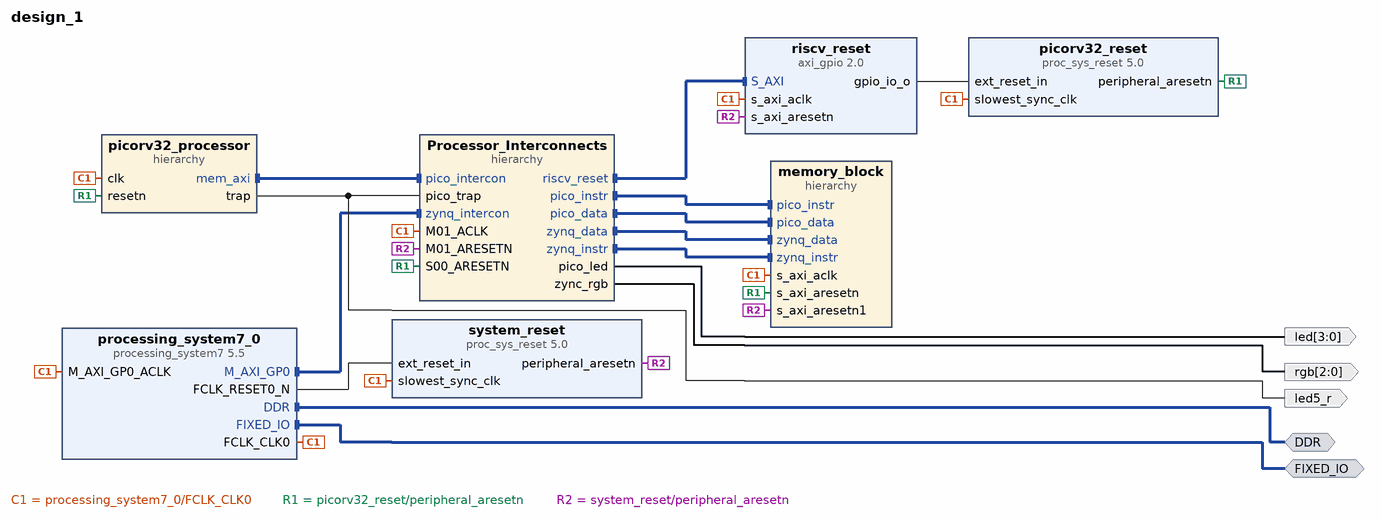
[diagram p0: block diagram of the top level]
# Vivado block design design_1, xc7z020clg400-1, Vivado 2023.2
create_bd_design design_1

create_bd_intf_port -mode Master -vlnv xilinx.com:interface:ddrx_rtl:1.0 DDR
create_bd_intf_port -mode Master -vlnv xilinx.com:display_processing_system7:fixedio_rtl:1.0 FIXED_IO
create_bd_port -dir O -from 3 -to 0 led
create_bd_port -dir O -from 2 -to 0 rgb
create_bd_port -dir O led5_r

create_bd_cell -type ip -vlnv xilinx.com:ip:proc_sys_reset:5.0 system_reset
create_bd_cell -type ip -vlnv xilinx.com:ip:processing_system7:5.5 processing_system7_0
set_property -dict [list \
  CONFIG.PCW_APU_PERIPHERAL_FREQMHZ 650 \
  CONFIG.PCW_CRYSTAL_PERIPHERAL_FREQMHZ 50 \
  CONFIG.PCW_ENET0_ENET0_IO {MIO 16 .. 27} \
  CONFIG.PCW_ENET0_GRP_MDIO_ENABLE 1 \
  CONFIG.PCW_ENET0_GRP_MDIO_IO {MIO 52 .. 53} \
  CONFIG.PCW_ENET0_PERIPHERAL_ENABLE 1 \
  CONFIG.PCW_ENET0_RESET_ENABLE 1 \
  CONFIG.PCW_ENET0_RESET_IO {MIO 9} \
  CONFIG.PCW_ENET_RESET_ENABLE 1 \
  CONFIG.PCW_ENET_RESET_SELECT {Share reset pin} \
  CONFIG.PCW_FPGA0_PERIPHERAL_FREQMHZ 100 \
  CONFIG.PCW_FPGA1_PERIPHERAL_FREQMHZ 50 \
  CONFIG.PCW_GPIO_MIO_GPIO_ENABLE 1 \
  CONFIG.PCW_GPIO_MIO_GPIO_IO MIO \
  CONFIG.PCW_I2C_RESET_ENABLE 1 \
  CONFIG.PCW_M_AXI_GP0_FREQMHZ 10 \
  CONFIG.PCW_PERIPHERAL_BOARD_PRESET None \
  CONFIG.PCW_PRESET_BANK1_VOLTAGE {LVCMOS 1.8V} \
  CONFIG.PCW_QSPI_GRP_FBCLK_ENABLE 1 \
  CONFIG.PCW_QSPI_GRP_FBCLK_IO {MIO 8} \
  CONFIG.PCW_QSPI_GRP_SINGLE_SS_ENABLE 1 \
  CONFIG.PCW_QSPI_GRP_SINGLE_SS_IO {MIO 1 .. 6} \
  CONFIG.PCW_QSPI_PERIPHERAL_ENABLE 1 \
  CONFIG.PCW_QSPI_QSPI_IO {MIO 1 .. 6} \
  CONFIG.PCW_SD0_GRP_CD_ENABLE 1 \
  CONFIG.PCW_SD0_GRP_CD_IO {MIO 47} \
  CONFIG.PCW_SD0_GRP_WP_ENABLE 0 \
  CONFIG.PCW_SD0_PERIPHERAL_ENABLE 1 \
  CONFIG.PCW_SD0_SD0_IO {MIO 40 .. 45} \
  CONFIG.PCW_SDIO_PERIPHERAL_FREQMHZ 50 \
  CONFIG.PCW_SINGLE_QSPI_DATA_MODE x4 \
  CONFIG.PCW_UART0_PERIPHERAL_ENABLE 1 \
  CONFIG.PCW_UART0_UART0_IO {MIO 14 .. 15} \
  CONFIG.PCW_UART1_PERIPHERAL_ENABLE 0 \
  CONFIG.PCW_UART_PERIPHERAL_FREQMHZ 100 \
  CONFIG.PCW_UIPARAM_DDR_BUS_WIDTH {16 Bit} \
  CONFIG.PCW_UIPARAM_DDR_FREQ_MHZ 525 \
  CONFIG.PCW_UIPARAM_DDR_PARTNO {MT41J256M16 RE-125} \
  CONFIG.PCW_USB0_PERIPHERAL_ENABLE 1 \
  CONFIG.PCW_USB0_RESET_ENABLE 1 \
  CONFIG.PCW_USB0_RESET_IO {MIO 46} \
  CONFIG.PCW_USB0_USB0_IO {MIO 28 .. 39} \
  CONFIG.PCW_USB_RESET_ENABLE 1 \
  CONFIG.PCW_USB_RESET_SELECT {Share reset pin} \
] [get_bd_cells processing_system7_0]
# 481 more settings of processing_system7_0 are not shown: defaults, MIO pin electricals, DDR timing, and values the tool derives
create_bd_cell -type ip -vlnv xilinx.com:ip:proc_sys_reset:5.0 picorv32_reset
create_bd_cell -type ip -vlnv xilinx.com:ip:axi_gpio:2.0 riscv_reset
set_property -dict {CONFIG.C_ALL_OUTPUTS 1 CONFIG.C_GPIO_WIDTH 1} [get_bd_cells riscv_reset]
create_bd_cell -type hier memory_block
create_bd_cell -type hier picorv32_processor
create_bd_cell -type hier Processor_Interconnects

# ---- hierarchy /memory_block ----
current_bd_instance /memory_block
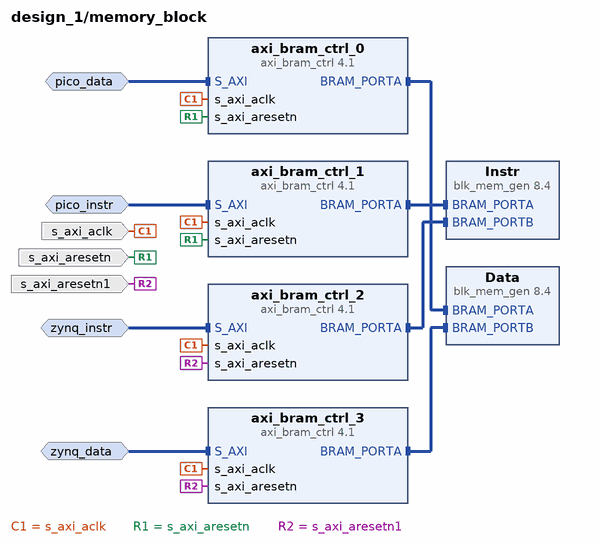
[diagram p1: block diagram inside /memory_block]
create_bd_intf_pin -mode Slave -vlnv xilinx.com:interface:aximm_rtl:1.0 pico_data
create_bd_intf_pin -mode Slave -vlnv xilinx.com:interface:aximm_rtl:1.0 pico_instr
create_bd_intf_pin -mode Slave -vlnv xilinx.com:interface:aximm_rtl:1.0 zynq_instr
create_bd_intf_pin -mode Slave -vlnv xilinx.com:interface:aximm_rtl:1.0 zynq_data
create_bd_pin -dir I -type clk s_axi_aclk
create_bd_pin -dir I -type rst s_axi_aresetn
create_bd_pin -dir I -type rst s_axi_aresetn1

create_bd_cell -type ip -vlnv xilinx.com:ip:axi_bram_ctrl:4.1 axi_bram_ctrl_0
set_property -dict {CONFIG.SINGLE_PORT_BRAM 1} [get_bd_cells axi_bram_ctrl_0]
create_bd_cell -type ip -vlnv xilinx.com:ip:axi_bram_ctrl:4.1 axi_bram_ctrl_1
set_property -dict {CONFIG.SINGLE_PORT_BRAM 1} [get_bd_cells axi_bram_ctrl_1]
create_bd_cell -type ip -vlnv xilinx.com:ip:axi_bram_ctrl:4.1 axi_bram_ctrl_2
set_property -dict {CONFIG.SINGLE_PORT_BRAM 1} [get_bd_cells axi_bram_ctrl_2]
create_bd_cell -type ip -vlnv xilinx.com:ip:axi_bram_ctrl:4.1 axi_bram_ctrl_3
set_property -dict {CONFIG.SINGLE_PORT_BRAM 1} [get_bd_cells axi_bram_ctrl_3]
create_bd_cell -type ip -vlnv xilinx.com:ip:blk_mem_gen:8.4 Data
set_property -dict [list \
  CONFIG.Memory_Type True_Dual_Port_RAM \
  CONFIG.Register_PortA_Output_of_Memory_Primitives false \
  CONFIG.Register_PortB_Output_of_Memory_Primitives false \
  CONFIG.Use_Byte_Write_Enable false \
  CONFIG.Write_Depth_A 32768 \
  CONFIG.Write_Width_A 32 \
  CONFIG.use_bram_block Stand_Alone \
] [get_bd_cells Data]
create_bd_cell -type ip -vlnv xilinx.com:ip:blk_mem_gen:8.4 Instr
set_property -dict [list \
  CONFIG.Memory_Type True_Dual_Port_RAM \
  CONFIG.Register_PortA_Output_of_Memory_Primitives false \
  CONFIG.Register_PortB_Output_of_Memory_Primitives false \
  CONFIG.Use_Byte_Write_Enable false \
  CONFIG.Write_Width_A 32 \
  CONFIG.use_bram_block Stand_Alone \
] [get_bd_cells Instr]

# ---- hierarchy /picorv32_processor ----
current_bd_instance /picorv32_processor
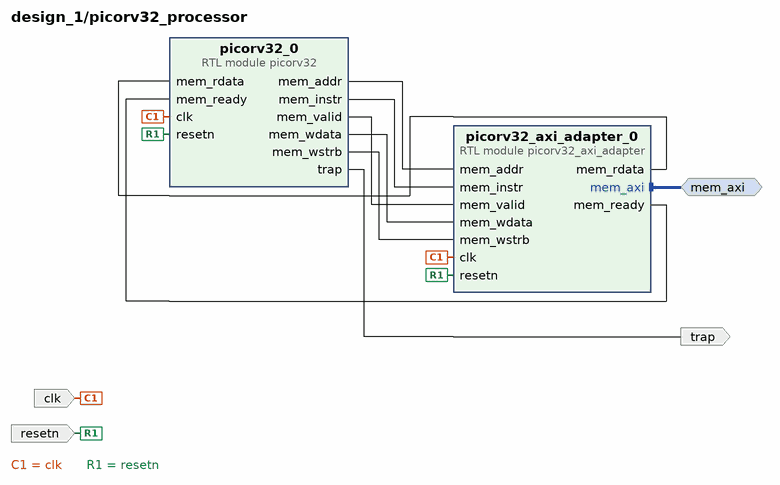
[diagram p2: block diagram inside /picorv32_processor]
create_bd_intf_pin -mode Master -vlnv xilinx.com:interface:aximm_rtl:1.0 mem_axi
create_bd_pin -dir I -type clk clk
create_bd_pin -dir I -type rst resetn
create_bd_pin -dir O trap

create_bd_cell -type module -reference picorv32 picorv32_0
set_property -dict [list \
  CONFIG.ENABLE_DIV 1 \
  CONFIG.ENABLE_MUL 1 \
  CONFIG.PROGADDR_IRQ 0x00000000 \
  CONFIG.PROGADDR_RESET 0x40000000 \
] [get_bd_cells picorv32_0]
create_bd_cell -type module -reference picorv32_axi_adapter picorv32_axi_adapter_0

# ---- hierarchy /Processor_Interconnects ----
current_bd_instance /Processor_Interconnects
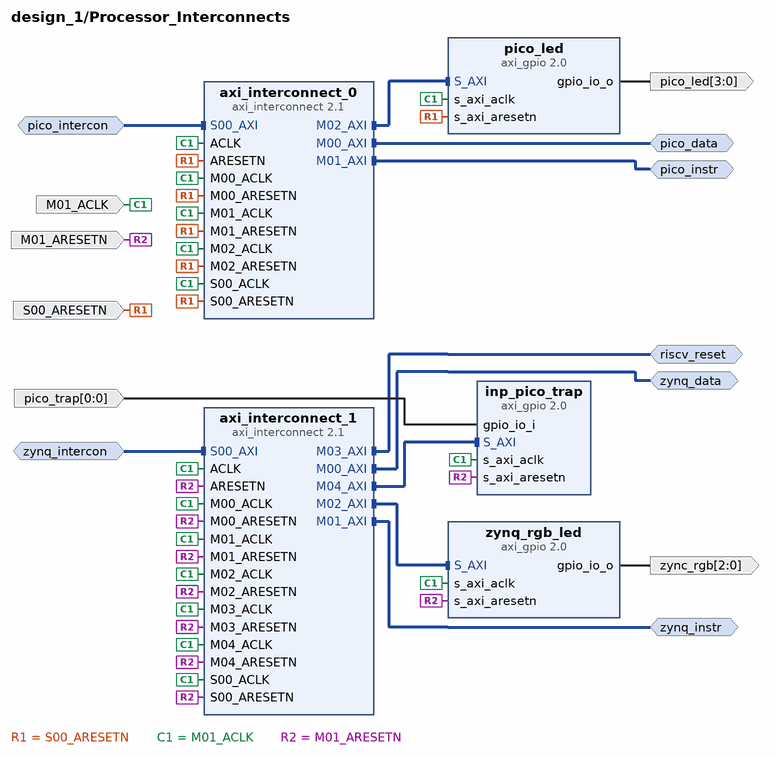
[diagram p3: block diagram inside /Processor_Interconnects]
create_bd_intf_pin -mode Slave -vlnv xilinx.com:interface:aximm_rtl:1.0 zynq_intercon
create_bd_intf_pin -mode Master -vlnv xilinx.com:interface:aximm_rtl:1.0 zynq_data
create_bd_intf_pin -mode Master -vlnv xilinx.com:interface:aximm_rtl:1.0 zynq_instr
create_bd_intf_pin -mode Master -vlnv xilinx.com:interface:aximm_rtl:1.0 riscv_reset
create_bd_intf_pin -mode Slave -vlnv xilinx.com:interface:aximm_rtl:1.0 pico_intercon
create_bd_intf_pin -mode Master -vlnv xilinx.com:interface:aximm_rtl:1.0 pico_data
create_bd_intf_pin -mode Master -vlnv xilinx.com:interface:aximm_rtl:1.0 pico_instr
create_bd_pin -dir I -type clk M01_ACLK
create_bd_pin -dir I -type rst M01_ARESETN
create_bd_pin -dir I -type rst S00_ARESETN
create_bd_pin -dir I -from 0 -to 0 pico_trap
create_bd_pin -dir O -from 2 -to 0 zync_rgb
create_bd_pin -dir O -from 3 -to 0 pico_led

create_bd_cell -type ip -vlnv xilinx.com:ip:axi_interconnect:2.1 axi_interconnect_1
set_property -dict {CONFIG.NUM_MI 5} [get_bd_cells axi_interconnect_1]
create_bd_cell -type ip -vlnv xilinx.com:ip:axi_interconnect:2.1 axi_interconnect_0
set_property -dict {CONFIG.NUM_MI 3} [get_bd_cells axi_interconnect_0]
create_bd_cell -type ip -vlnv xilinx.com:ip:axi_gpio:2.0 inp_pico_trap
set_property -dict {CONFIG.C_ALL_INPUTS 1 CONFIG.C_GPIO_WIDTH 1} [get_bd_cells inp_pico_trap]
create_bd_cell -type ip -vlnv xilinx.com:ip:axi_gpio:2.0 zynq_rgb_led
set_property -dict {CONFIG.C_ALL_OUTPUTS 1 CONFIG.C_GPIO_WIDTH 3 CONFIG.GPIO_BOARD_INTERFACE Custom} [get_bd_cells zynq_rgb_led]
create_bd_cell -type ip -vlnv xilinx.com:ip:axi_gpio:2.0 pico_led
set_property -dict {CONFIG.GPIO_BOARD_INTERFACE leds_4bits} [get_bd_cells pico_led]

# ---- connections ----

current_bd_instance /memory_block
connect_bd_intf_net [get_bd_intf_pins axi_bram_ctrl_0/BRAM_PORTA] [get_bd_intf_pins Data/BRAM_PORTA]
connect_bd_intf_net [get_bd_intf_pins axi_bram_ctrl_1/BRAM_PORTA] [get_bd_intf_pins Instr/BRAM_PORTA]
connect_bd_intf_net [get_bd_intf_pins axi_bram_ctrl_2/BRAM_PORTA] [get_bd_intf_pins Instr/BRAM_PORTB]
connect_bd_intf_net [get_bd_intf_pins axi_bram_ctrl_3/BRAM_PORTA] [get_bd_intf_pins Data/BRAM_PORTB]
connect_bd_intf_net -intf_net axi_interconnect_0_M00_AXI [get_bd_intf_pins pico_data] [get_bd_intf_pins axi_bram_ctrl_0/S_AXI]
connect_bd_intf_net -intf_net axi_interconnect_0_M01_AXI [get_bd_intf_pins pico_instr] [get_bd_intf_pins axi_bram_ctrl_1/S_AXI]
connect_bd_intf_net -intf_net axi_interconnect_1_M00_AXI [get_bd_intf_pins zynq_data] [get_bd_intf_pins axi_bram_ctrl_3/S_AXI]
connect_bd_intf_net -intf_net axi_interconnect_1_M01_AXI [get_bd_intf_pins zynq_instr] [get_bd_intf_pins axi_bram_ctrl_2/S_AXI]
connect_bd_net -net clk_wiz_clk_out1 [get_bd_pins s_axi_aclk] \
  [get_bd_pins axi_bram_ctrl_1/s_axi_aclk] [get_bd_pins axi_bram_ctrl_2/s_axi_aclk] [get_bd_pins axi_bram_ctrl_3/s_axi_aclk] \
  [get_bd_pins axi_bram_ctrl_0/s_axi_aclk]
connect_bd_net -net rst_clk_wiz_100M1_peripheral_aresetn [get_bd_pins s_axi_aresetn] \
  [get_bd_pins axi_bram_ctrl_1/s_axi_aresetn] [get_bd_pins axi_bram_ctrl_0/s_axi_aresetn]
connect_bd_net -net rst_clk_wiz_100M_peripheral_aresetn [get_bd_pins s_axi_aresetn1] \
  [get_bd_pins axi_bram_ctrl_3/s_axi_aresetn] [get_bd_pins axi_bram_ctrl_2/s_axi_aresetn]
set_property HDL_ATTRIBUTE.BMM_INFO_ADDRESS_SPACE {byte  0x40000000 32 > design_1 memory_block/Instr} [get_bd_cells axi_bram_ctrl_2]
set_property HDL_ATTRIBUTE.KEEP_HIERARCHY yes [get_bd_cells axi_bram_ctrl_2]
set_property HDL_ATTRIBUTE.BMM_INFO_ADDRESS_SPACE {byte  0x42000000 32 > design_1 memory_block/Data} [get_bd_cells axi_bram_ctrl_3]
set_property HDL_ATTRIBUTE.KEEP_HIERARCHY yes [get_bd_cells axi_bram_ctrl_3]

current_bd_instance /picorv32_processor
connect_bd_intf_net [get_bd_intf_pins picorv32_axi_adapter_0/mem_axi] [get_bd_intf_pins mem_axi]
connect_bd_net -net clk_wiz_clk_out1 [get_bd_pins clk] [get_bd_pins picorv32_0/clk] [get_bd_pins picorv32_axi_adapter_0/clk]
connect_bd_net [get_bd_pins picorv32_0/mem_addr] [get_bd_pins picorv32_axi_adapter_0/mem_addr]
connect_bd_net [get_bd_pins picorv32_0/mem_instr] [get_bd_pins picorv32_axi_adapter_0/mem_instr]
connect_bd_net [get_bd_pins picorv32_0/mem_valid] [get_bd_pins picorv32_axi_adapter_0/mem_valid]
connect_bd_net [get_bd_pins picorv32_0/mem_wdata] [get_bd_pins picorv32_axi_adapter_0/mem_wdata]
connect_bd_net [get_bd_pins picorv32_0/mem_wstrb] [get_bd_pins picorv32_axi_adapter_0/mem_wstrb]
connect_bd_net [get_bd_pins picorv32_0/trap] [get_bd_pins trap]
connect_bd_net [get_bd_pins picorv32_axi_adapter_0/mem_rdata] [get_bd_pins picorv32_0/mem_rdata]
connect_bd_net [get_bd_pins picorv32_axi_adapter_0/mem_ready] [get_bd_pins picorv32_0/mem_ready]
connect_bd_net -net rst_clk_wiz_100M1_peripheral_aresetn [get_bd_pins resetn] \
  [get_bd_pins picorv32_0/resetn] [get_bd_pins picorv32_axi_adapter_0/resetn]

current_bd_instance /Processor_Interconnects
connect_bd_intf_net [get_bd_intf_pins axi_interconnect_0/S00_AXI] [get_bd_intf_pins pico_intercon]
connect_bd_intf_net [get_bd_intf_pins axi_interconnect_0/M00_AXI] [get_bd_intf_pins pico_data]
connect_bd_intf_net [get_bd_intf_pins axi_interconnect_0/M01_AXI] [get_bd_intf_pins pico_instr]
connect_bd_intf_net [get_bd_intf_pins axi_interconnect_0/M02_AXI] [get_bd_intf_pins pico_led/S_AXI]
connect_bd_intf_net [get_bd_intf_pins zynq_data] [get_bd_intf_pins axi_interconnect_1/M00_AXI]
connect_bd_intf_net [get_bd_intf_pins zynq_instr] [get_bd_intf_pins axi_interconnect_1/M01_AXI]
connect_bd_intf_net [get_bd_intf_pins axi_interconnect_1/M02_AXI] [get_bd_intf_pins zynq_rgb_led/S_AXI]
connect_bd_intf_net [get_bd_intf_pins riscv_reset] [get_bd_intf_pins axi_interconnect_1/M03_AXI]
connect_bd_intf_net [get_bd_intf_pins axi_interconnect_1/M04_AXI] [get_bd_intf_pins inp_pico_trap/S_AXI]
connect_bd_intf_net -intf_net processing_system7_0_M_AXI_GP0 [get_bd_intf_pins zynq_intercon] [get_bd_intf_pins axi_interconnect_1/S00_AXI]
connect_bd_net [get_bd_pins S00_ARESETN] \
  [get_bd_pins axi_interconnect_0/S00_ARESETN] [get_bd_pins axi_interconnect_0/M00_ARESETN] \
  [get_bd_pins axi_interconnect_0/M01_ARESETN] [get_bd_pins axi_interconnect_0/M02_ARESETN] \
  [get_bd_pins axi_interconnect_0/ARESETN] [get_bd_pins pico_led/s_axi_aresetn]
connect_bd_net -net clk_wiz_clk_out1 [get_bd_pins M01_ACLK] \
  [get_bd_pins axi_interconnect_1/M01_ACLK] [get_bd_pins axi_interconnect_1/M00_ACLK] \
  [get_bd_pins axi_interconnect_1/S00_ACLK] [get_bd_pins axi_interconnect_1/M02_ACLK] \
  [get_bd_pins axi_interconnect_1/M03_ACLK] [get_bd_pins axi_interconnect_1/M04_ACLK] [get_bd_pins axi_interconnect_1/ACLK] \
  [get_bd_pins axi_interconnect_0/M00_ACLK] [get_bd_pins axi_interconnect_0/M01_ACLK] \
  [get_bd_pins axi_interconnect_0/S00_ACLK] [get_bd_pins axi_interconnect_0/M02_ACLK] [get_bd_pins axi_interconnect_0/ACLK] \
  [get_bd_pins inp_pico_trap/s_axi_aclk] [get_bd_pins zynq_rgb_led/s_axi_aclk] [get_bd_pins pico_led/s_axi_aclk]
connect_bd_net -net gpio_io_i_1 [get_bd_pins pico_trap] [get_bd_pins inp_pico_trap/gpio_io_i]
connect_bd_net [get_bd_pins pico_led/gpio_io_o] [get_bd_pins pico_led]
connect_bd_net -net rst_clk_wiz_100M_peripheral_aresetn [get_bd_pins M01_ARESETN] \
  [get_bd_pins axi_interconnect_1/M01_ARESETN] [get_bd_pins axi_interconnect_1/M00_ARESETN] \
  [get_bd_pins axi_interconnect_1/S00_ARESETN] [get_bd_pins axi_interconnect_1/M02_ARESETN] \
  [get_bd_pins axi_interconnect_1/M03_ARESETN] [get_bd_pins axi_interconnect_1/M04_ARESETN] \
  [get_bd_pins axi_interconnect_1/ARESETN] [get_bd_pins inp_pico_trap/s_axi_aresetn] [get_bd_pins zynq_rgb_led/s_axi_aresetn]
connect_bd_net [get_bd_pins zynq_rgb_led/gpio_io_o] [get_bd_pins zync_rgb]

current_bd_instance /
connect_bd_intf_net -intf_net S_AXI1_1 [get_bd_intf_pins memory_block/pico_instr] [get_bd_intf_pins Processor_Interconnects/pico_instr]
connect_bd_intf_net -intf_net S_AXI_1 [get_bd_intf_pins memory_block/pico_data] [get_bd_intf_pins Processor_Interconnects/pico_data]
connect_bd_intf_net -intf_net axi_interconnect_1_M00_AXI [get_bd_intf_pins Processor_Interconnects/zynq_data] [get_bd_intf_pins memory_block/zynq_data]
connect_bd_intf_net -intf_net axi_interconnect_1_M01_AXI [get_bd_intf_pins Processor_Interconnects/zynq_instr] [get_bd_intf_pins memory_block/zynq_instr]
connect_bd_intf_net -intf_net axi_interconnect_1_M03_AXI [get_bd_intf_pins Processor_Interconnects/riscv_reset] [get_bd_intf_pins riscv_reset/S_AXI]
connect_bd_intf_net [get_bd_intf_pins picorv32_processor/mem_axi] [get_bd_intf_pins Processor_Interconnects/pico_intercon]
connect_bd_intf_net [get_bd_intf_ports DDR] [get_bd_intf_pins processing_system7_0/DDR]
connect_bd_intf_net [get_bd_intf_ports FIXED_IO] [get_bd_intf_pins processing_system7_0/FIXED_IO]
connect_bd_intf_net [get_bd_intf_pins processing_system7_0/M_AXI_GP0] [get_bd_intf_pins Processor_Interconnects/zynq_intercon]
connect_bd_net -net Processor_Interconnects_led [get_bd_pins Processor_Interconnects/pico_led] [get_bd_ports led]
connect_bd_net -net Processor_Interconnects_rgb [get_bd_pins Processor_Interconnects/zync_rgb] [get_bd_ports rgb]
connect_bd_net -net axi_gpio_1_gpio_io_o [get_bd_pins riscv_reset/gpio_io_o] [get_bd_pins picorv32_reset/ext_reset_in]
connect_bd_net -net clk_wiz_clk_out1 [get_bd_pins processing_system7_0/FCLK_CLK0] \
  [get_bd_pins system_reset/slowest_sync_clk] [get_bd_pins processing_system7_0/M_AXI_GP0_ACLK] \
  [get_bd_pins picorv32_reset/slowest_sync_clk] [get_bd_pins riscv_reset/s_axi_aclk] [get_bd_pins memory_block/s_axi_aclk] \
  [get_bd_pins picorv32_processor/clk] [get_bd_pins Processor_Interconnects/M01_ACLK]
connect_bd_net -net picorv32_0_trap [get_bd_pins picorv32_processor/trap] [get_bd_ports led5_r] [get_bd_pins Processor_Interconnects/pico_trap]
connect_bd_net [get_bd_pins processing_system7_0/FCLK_RESET0_N] [get_bd_pins system_reset/ext_reset_in]
connect_bd_net -net rst_clk_wiz_100M1_peripheral_aresetn [get_bd_pins picorv32_reset/peripheral_aresetn] \
  [get_bd_pins memory_block/s_axi_aresetn] [get_bd_pins picorv32_processor/resetn] \
  [get_bd_pins Processor_Interconnects/S00_ARESETN]
connect_bd_net -net rst_clk_wiz_100M_peripheral_aresetn [get_bd_pins system_reset/peripheral_aresetn] \
  [get_bd_pins riscv_reset/s_axi_aresetn] [get_bd_pins memory_block/s_axi_aresetn1] \
  [get_bd_pins Processor_Interconnects/M01_ARESETN]
set_property HDL_ATTRIBUTE.BMM_INFO_PROCESSOR {arm > design_1 memory_block/axi_bram_ctrl_2 design_1 memory_block/axi_bram_ctrl_3} [get_bd_cells processing_system7_0]
set_property HDL_ATTRIBUTE.KEEP_HIERARCHY yes [get_bd_cells processing_system7_0]

# ---- address map ----
assign_bd_address -offset 0x40000000 -range 8K -target_address_space [get_bd_addr_spaces picorv32_processor/picorv32_axi_adapter_0/mem_axi] [get_bd_addr_segs memory_block/axi_bram_ctrl_1/S_AXI/Mem0]
assign_bd_address -offset 0x40010000 -range 64K -target_address_space [get_bd_addr_spaces picorv32_processor/picorv32_axi_adapter_0/mem_axi] [get_bd_addr_segs Processor_Interconnects/pico_led/S_AXI/Reg]
assign_bd_address -offset 0x42000000 -range 32K -target_address_space [get_bd_addr_spaces picorv32_processor/picorv32_axi_adapter_0/mem_axi] [get_bd_addr_segs memory_block/axi_bram_ctrl_0/S_AXI/Mem0]
assign_bd_address -offset 0x40000000 -range 8K -target_address_space [get_bd_addr_spaces processing_system7_0/Data] [get_bd_addr_segs memory_block/axi_bram_ctrl_2/S_AXI/Mem0]
assign_bd_address -offset 0x41200000 -range 64K -target_address_space [get_bd_addr_spaces processing_system7_0/Data] [get_bd_addr_segs Processor_Interconnects/zynq_rgb_led/S_AXI/Reg]
assign_bd_address -offset 0x41210000 -range 64K -target_address_space [get_bd_addr_spaces processing_system7_0/Data] [get_bd_addr_segs riscv_reset/S_AXI/Reg]
assign_bd_address -offset 0x41220000 -range 8K -target_address_space [get_bd_addr_spaces processing_system7_0/Data] [get_bd_addr_segs Processor_Interconnects/inp_pico_trap/S_AXI/Reg]
assign_bd_address -offset 0x42000000 -range 32K -target_address_space [get_bd_addr_spaces processing_system7_0/Data] [get_bd_addr_segs memory_block/axi_bram_ctrl_3/S_AXI/Mem0]

validate_bd_design
save_bd_design
